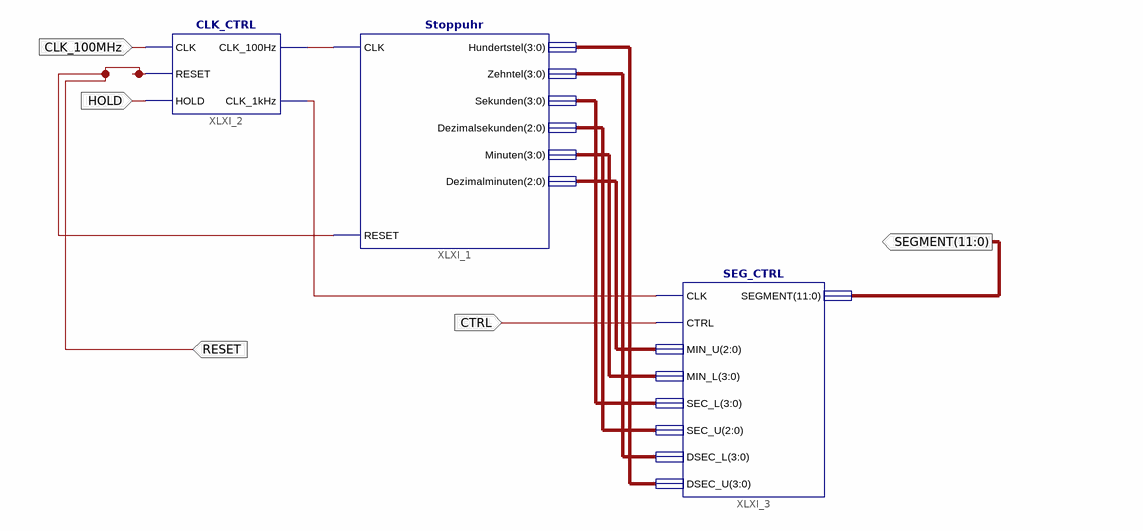
[diagram p0: schematic sheet 1]
// Xilinx ISE schematic Digital_BCD_Clock.sch (spartan6) as structural Verilog: 3 symbols, 5 ports
module Digital_BCD_Clock (
  input  CTRL,
  input  HOLD,
  input  RESET,
  input  CLK_100MHz,
  output [11:0] SEGMENT
);

  wire XLXN_1, XLXN_2;
  wire [2:0] XLXN_9, XLXN_11;
  wire [3:0] XLXN_10, XLXN_12, XLXN_13, XLXN_14;

  Stoppuhr XLXI_1 (
    .RESET(RESET), .CLK(XLXN_1), .Hundertstel(XLXN_14), .Zehntel(XLXN_13), .Sekunden(XLXN_12),
    .Dezimalsekunden(XLXN_11), .Minuten(XLXN_10), .Dezimalminuten(XLXN_9));
  CLK_CTRL XLXI_2 (.CLK(CLK_100MHz), .RESET(RESET), .HOLD(HOLD), .CLK_100Hz(XLXN_1), .CLK_1kHz(XLXN_2));
  SEG_CTRL XLXI_3 (
    .CLK(XLXN_2), .CTRL(CTRL), .MIN_U(XLXN_9), .MIN_L(XLXN_10), .SEC_L(XLXN_12), .SEC_U(XLXN_11),
    .DSEC_L(XLXN_13), .DSEC_U(XLXN_14), .SEGMENT(SEGMENT));
endmodule
